# EAGLE design 2020-10-27 AD590 HIH-4031 (EAGLE 9.6.2)
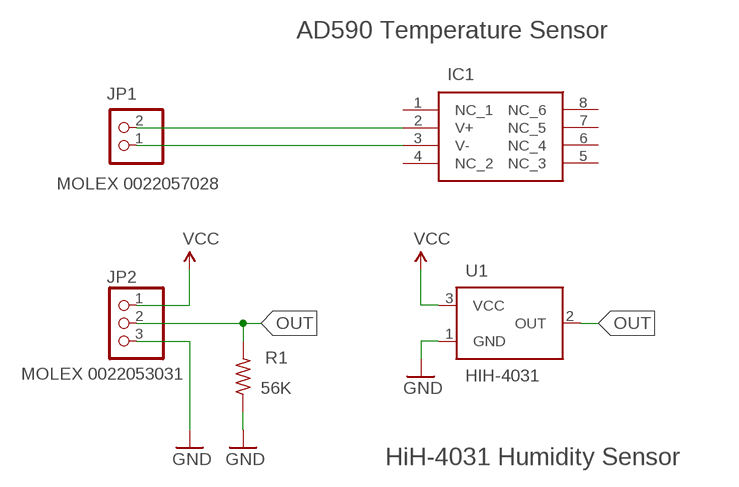
[diagram p0: schematic, sheet 1]

## Parts
IC1  AD590JRZ  [SOIC127P600X175-8N]
JP1  MOLEX 0022057028  PINHD-1X2MOLEX-02-90DEG  [MOLEX-7395-02-90DEG]
JP2  MOLEX 0022053031  PINHD-1X3MOLEX-7395-03-RA  [MOLEX-7395-03-90DEG]
R1  56K  R-US_R0805  [R0805]
U1  HIH-4031  HIH-4030  [HIH-4030]

## Nets
GND: JP2.3 R1.1 U1.1(GND)
OUT: JP2.2 R1.2 U1.2(OUT)
V+: IC1.2(V+) JP1.2
V-: IC1.3(V-) JP1.1
VCC: JP2.1 U1.3(VCC)
Unconnected: IC1.1(NC_1) IC1.4(NC_2) IC1.5(NC_3) IC1.6(NC_4) IC1.7(NC_5) IC1.8(NC_6)

## Notes on the sheet
- AD590 Temperature Sensor
- HiH-4031 Humidity Sensor

## Library data of the parts
IC1 = AUmlib:AD590JRZ: AD590JRZ, Temperature Sensor +/-5C 4 to 30V 8-Pin SOIC Source: Datasheet <http://www.analog.com/static/imported-files/data_sheets/AD590.pdf>; DESCRIPTION: AD590JRZ, Temperature Sensor +/-5C 4 to 30V 8-Pin SOIC; HEIGHT: 1.75mm; MANUFACTURER_NAME: Analog Devices; MANUFACTURER_PART_NUMBER: AD590JRZ; MOUSER_PART_NUMBER: 584-AD590JRZ; MOUSER_PRICE-STOCK: https://www.mouser.com/Search/Refine.aspx?Keyword=584-AD590JRZ; RS_PART_NUMBER: 7096005P; RS_PRICE-STOCK: http://uk.rs-online.com/web/p/products/7096005P
JP1 = AUmlib:PINHD-1X2: PIN HEADER
JP2 = AUmlib:PINHD-1X3: PIN HEADER
R1 = AUmlib:R-US_: RESISTOR, American symbol; SPICEPREFIX: R
U1 = AUmlib:HIH-4030: Honeywell HIH-4030 Humidity Sensor - Analog Output The HIH-4030/4031 Series delivers instrumentation-quality RH (Relative Humidity) sensing performance in a competitively priced, solderable SMD. Datasheet <https://www.sparkfun.com/datasheets/Sensors/Weather/SEN-09569-HIH-4030-datasheet.pdf> SparkFun Products SparkFun Humidity Sensor Breakout - HIH-4030 <https://www.sparkfun.com/products/9569> (SEN-09569); PROD_ID: IC-09448

## Board
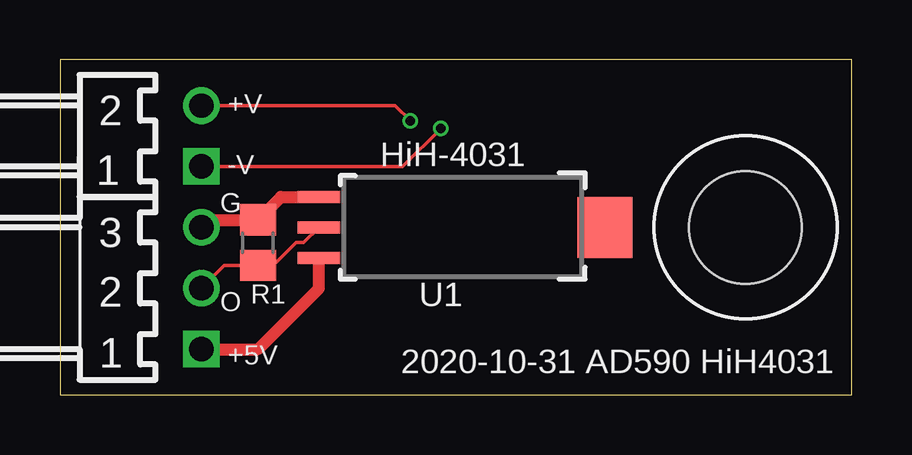
[diagram p1: board, top side]
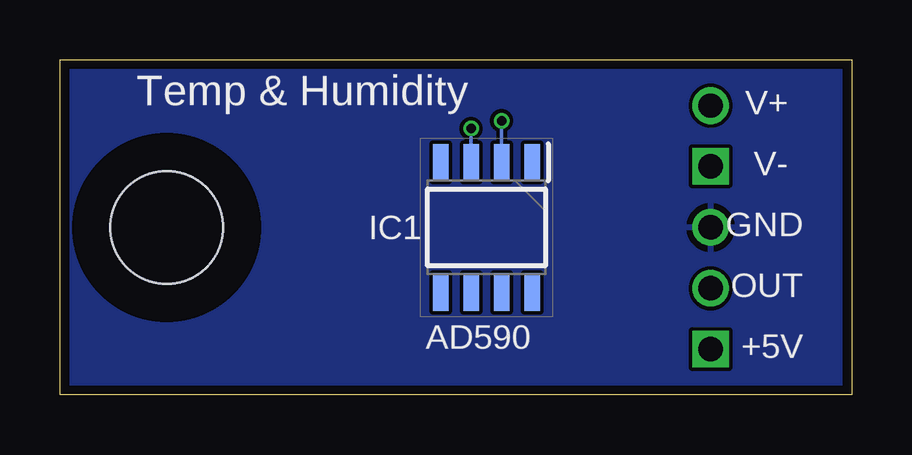
[diagram p2: board, bottom side, seen from below]

Size 33.02 x 13.97 mm. Coordinates in mm from the lower left corner, seen from the top.
Outline: 0,0 33.02,0 33.02,13.97 0,13.97 0,0
Copper layers (1*16): Top 0.035559375mm / dielectric 1.6mm / Bottom 0.035559375mm
Design rules "oshpark-2layer": minimum track width 6mil, minimum drill 10mil, track to track 6mil, track to pad 6mil, pad to pad 6mil, via to via 6mil, smd to smd 6mil, copper to edge 15mil, drill to drill 6mil, minimum pad ring 5mil, minimum via ring 5mil, stop-mask expansion 2.5mil, vias tented up to drill 0mil, thermal gap 10mil
Holes 4.7 mm at 28.57,6.99
bRestrict: area 24.8,3.2 to 32.4,10.8

### Footprints (pad centres in the part's own frame; a part is rotated, then mirrored left to right if it is on the bottom)
SOIC127P600X175-8N = smd 1.525 x 0.65: 1 -2.712,1.905; 2 -2.712,0.635; 3 -2.712,-0.635; 4 -2.712,-1.905; 5 2.712,-1.905; 6 2.712,-0.635; 7 2.712,0.635; 8 2.712,1.905
MOLEX-7395-02-90DEG = drill 1.016 square: 1 1.27,0 | drill 1.016: 2 -1.27,0
MOLEX-7395-03-90DEG = drill 1.016 square: 1 2.54,0 | drill 1.016: 2 0,0; 3 -2.54,0
R0805 = smd 1.3 x 1.5: 1 -0.95,0; 2 0.95,0
HIH-4030 = smd 0.508 x 1.778: 1 -1.27,-5.08; 2 0,-5.08; 3 1.27,-5.08 | smd 2.54 x 2.286: NC 0,6.842

### Placement (x,y rotation side)
IC1  AD590  [SOIC127P600X175-8N]  15.24,6.99 270 bottom
JP1  5.89,10.79 270 top
JP2  5.89,4.45 270 top
R1  8.26,6.35 270 top
U1  15.88,6.99 270 top

### Tracks (layer width: path | path; a pad name or v marks a point on that pad's centre or on a via)
GND
  Top 0.508: JP2.3 6.21,7.3 R1.1 9.21,8.26 U1.1
  pour Bottom: 0,0 0,13.97 33.02,13.97 33.02,0
OUT
  Top 0.152: U1.2 10.16,6.35 9.84,6.35 8.89,5.4 R1.2 6.85,5.4 JP2.2
V+  (via drill 0.4)
  Top 0.152: JP1.2 13.97,12.06 v14.61,11.43
  Bottom 0.152: v14.61,11.43 IC1.2
V-  (via drill 0.4)
  Top 0.152: v15.88,11.11 14.29,9.53 JP1.1
  Bottom 0.152: IC1.3 v15.88,11.11
VCC
  Top 0.508: U1.3 10.79,4.45 8.26,1.91 JP2.1

### Text on the board
tPlace: +V | HiH-4031 | -V | G | O | 2020-10-31 AD590 HiH4031 | +5V
bPlace: V+ | Temp & Humidity | V- | GND | OUT | +5V | AD590